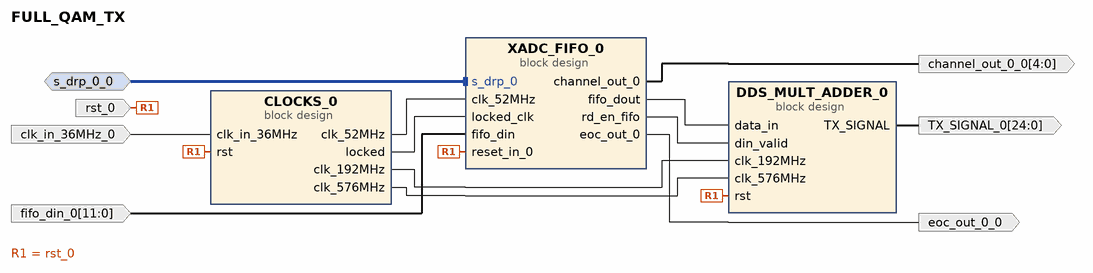
[diagram p0: block diagram of the top level]
# Vivado block design FULL_QAM_TX, xc7vx485tffg1157-1, Vivado 2021.2
create_bd_design FULL_QAM_TX

create_bd_intf_port -mode Slave -vlnv xilinx.com:interface:drp_rtl:1.0 s_drp_0_0
create_bd_port -dir I -type rst rst_0
set_property -dict {CONFIG.POLARITY ACTIVE_HIGH} [get_bd_ports rst_0]
create_bd_port -dir I -type clk clk_in_36MHz_0
set_property -dict {CONFIG.FREQ_HZ 36000000} [get_bd_ports clk_in_36MHz_0]
create_bd_port -dir O -from 4 -to 0 channel_out_0_0
create_bd_port -dir O eoc_out_0_0
create_bd_port -dir O -from 24 -to 0 -type data TX_SIGNAL_0
create_bd_port -dir I -from 11 -to 0 fifo_din_0

create_bd_cell -type container -reference CLOCKS CLOCKS_0
set_property -dict [list \
  CONFIG.ACTIVE_SIM_BD CLOCKS.bd \
  CONFIG.ACTIVE_SYNTH_BD CLOCKS.bd \
  CONFIG.ENABLE_DFX 0 \
  CONFIG.LIST_SIM_BD CLOCKS.bd \
  CONFIG.LIST_SYNTH_BD CLOCKS.bd \
  CONFIG.LOCK_PROPAGATE 0 \
] [get_bd_cells CLOCKS_0]
create_bd_cell -type container -reference DDS_MULT_ADDER DDS_MULT_ADDER_0
set_property -dict [list \
  CONFIG.ACTIVE_SIM_BD DDS_MULT_ADDER.bd \
  CONFIG.ACTIVE_SYNTH_BD DDS_MULT_ADDER.bd \
  CONFIG.ENABLE_DFX 0 \
  CONFIG.LIST_SIM_BD DDS_MULT_ADDER.bd \
  CONFIG.LIST_SYNTH_BD DDS_MULT_ADDER.bd \
  CONFIG.LOCK_PROPAGATE 0 \
] [get_bd_cells DDS_MULT_ADDER_0]
create_bd_cell -type container -reference XADC_FIFO XADC_FIFO_0
set_property -dict [list \
  CONFIG.ACTIVE_SIM_BD XADC_FIFO.bd \
  CONFIG.ACTIVE_SYNTH_BD XADC_FIFO.bd \
  CONFIG.ENABLE_DFX 0 \
  CONFIG.LIST_SIM_BD XADC_FIFO.bd \
  CONFIG.LIST_SYNTH_BD XADC_FIFO.bd \
  CONFIG.LOCK_PROPAGATE 0 \
] [get_bd_cells XADC_FIFO_0]

# ---- connections ----

connect_bd_intf_net -intf_net s_drp_0_0_1 [get_bd_intf_ports s_drp_0_0] [get_bd_intf_pins XADC_FIFO_0/s_drp_0]
connect_bd_net [get_bd_pins CLOCKS_0/clk_192MHz] [get_bd_pins DDS_MULT_ADDER_0/clk_192MHz]
connect_bd_net [get_bd_pins CLOCKS_0/clk_52MHz] [get_bd_pins XADC_FIFO_0/clk_52MHz]
connect_bd_net [get_bd_pins CLOCKS_0/clk_576MHz] [get_bd_pins DDS_MULT_ADDER_0/clk_576MHz]
connect_bd_net [get_bd_pins CLOCKS_0/locked] [get_bd_pins XADC_FIFO_0/locked_clk]
connect_bd_net [get_bd_pins DDS_MULT_ADDER_0/TX_SIGNAL] [get_bd_ports TX_SIGNAL_0]
connect_bd_net [get_bd_pins XADC_FIFO_0/channel_out_0] [get_bd_ports channel_out_0_0]
connect_bd_net [get_bd_pins XADC_FIFO_0/eoc_out_0] [get_bd_ports eoc_out_0_0]
connect_bd_net [get_bd_pins XADC_FIFO_0/fifo_dout] [get_bd_pins DDS_MULT_ADDER_0/data_in]
connect_bd_net [get_bd_pins XADC_FIFO_0/rd_en_fifo] [get_bd_pins DDS_MULT_ADDER_0/din_valid]
connect_bd_net -net clk_in_36MHz_0_1 [get_bd_ports clk_in_36MHz_0] [get_bd_pins CLOCKS_0/clk_in_36MHz]
connect_bd_net -net fifo_din_0_1 [get_bd_ports fifo_din_0] [get_bd_pins XADC_FIFO_0/fifo_din]
connect_bd_net -net rst_0_1 [get_bd_ports rst_0] [get_bd_pins CLOCKS_0/rst] [get_bd_pins XADC_FIFO_0/reset_in_0] [get_bd_pins DDS_MULT_ADDER_0/rst]

validate_bd_design
save_bd_design
